# Altium schematic sheet LIS3MDL.SchDoc
size A4; Organization: Altium Limited; Address1: L3, 12a Rodborough Rd; Address2: Frenchs Forest; Address3: NSW; Address4: Australia 2086; SheetNumber: 4; SheetTotal: 11
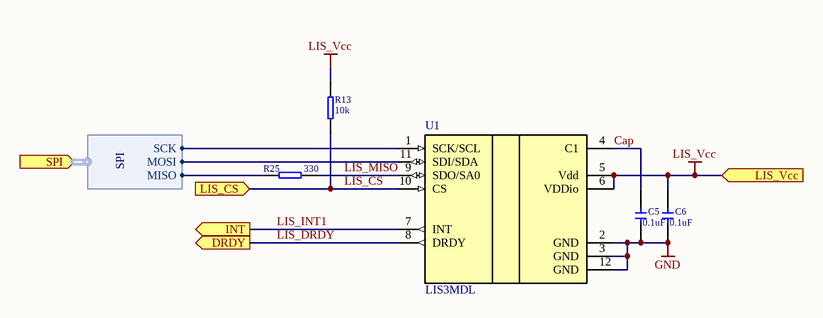
[diagram p0: LIS3MDL.SchDoc]

## Parts
C5  value 0.1uF  [CERCAP 0603]
C6  value 0.1uF  [CERCAP 0603]
R13  value 10k  [RES 0603]
R25  value 330  [RES 0603]
U1  LIS3MDL  [LGA12_LIS3MDL]

## Ports
DRDY (out), INT (out), LIS_CS (in), LIS_Vcc (in), SPI (in, harness SPI)

## Harnesses
SPI: SCK, MISO, MOSI

## Nets
GND: C5.1 C6.1 U1.2(GND) U1.3(GND) U1.12(GND)
LIS_Vcc: C6.2 R13.2 U1.5(Vdd) U1.6(VDDio) ; port LIS_Vcc
Cap: C5.2 U1.4(C1)
LIS_CS: R13.1 U1.10(CS) ; port LIS_CS
LIS_DRDY: U1.8(DRDY) ; port DRDY
LIS_INT1: U1.7(INT) ; port INT
LIS_MISO: R25.1 U1.9(SDO/SA0)
NetR25_2: R25.2 ; port SPI.MISO
NetU1_1: U1.1(SCK/SCL) ; port SPI.SCK
NetU1_11: U1.11(SDI/SDA) ; port SPI.MOSI

## Notes on the sheet
- Title
- Size:
- Date:
- A4
- Number:
- Time:
- Revision:
- Sheet
- of
- File:

## Library data of the parts
C5 C6 = !Capacitor: Capacitor; IsSMT: NoSMT; Diel: X7R; Voltage: *
R13 R25 = !Resistor: Resistor; IsSMT: NoSMT
U1 = LIS3MDL: Mag; IsSMT: NoSMT